# Altium schematic sheet KSZ8851SNL.SchDoc
size 355 x 203 mm; SheetNumber: 2; SheetTotal: 3
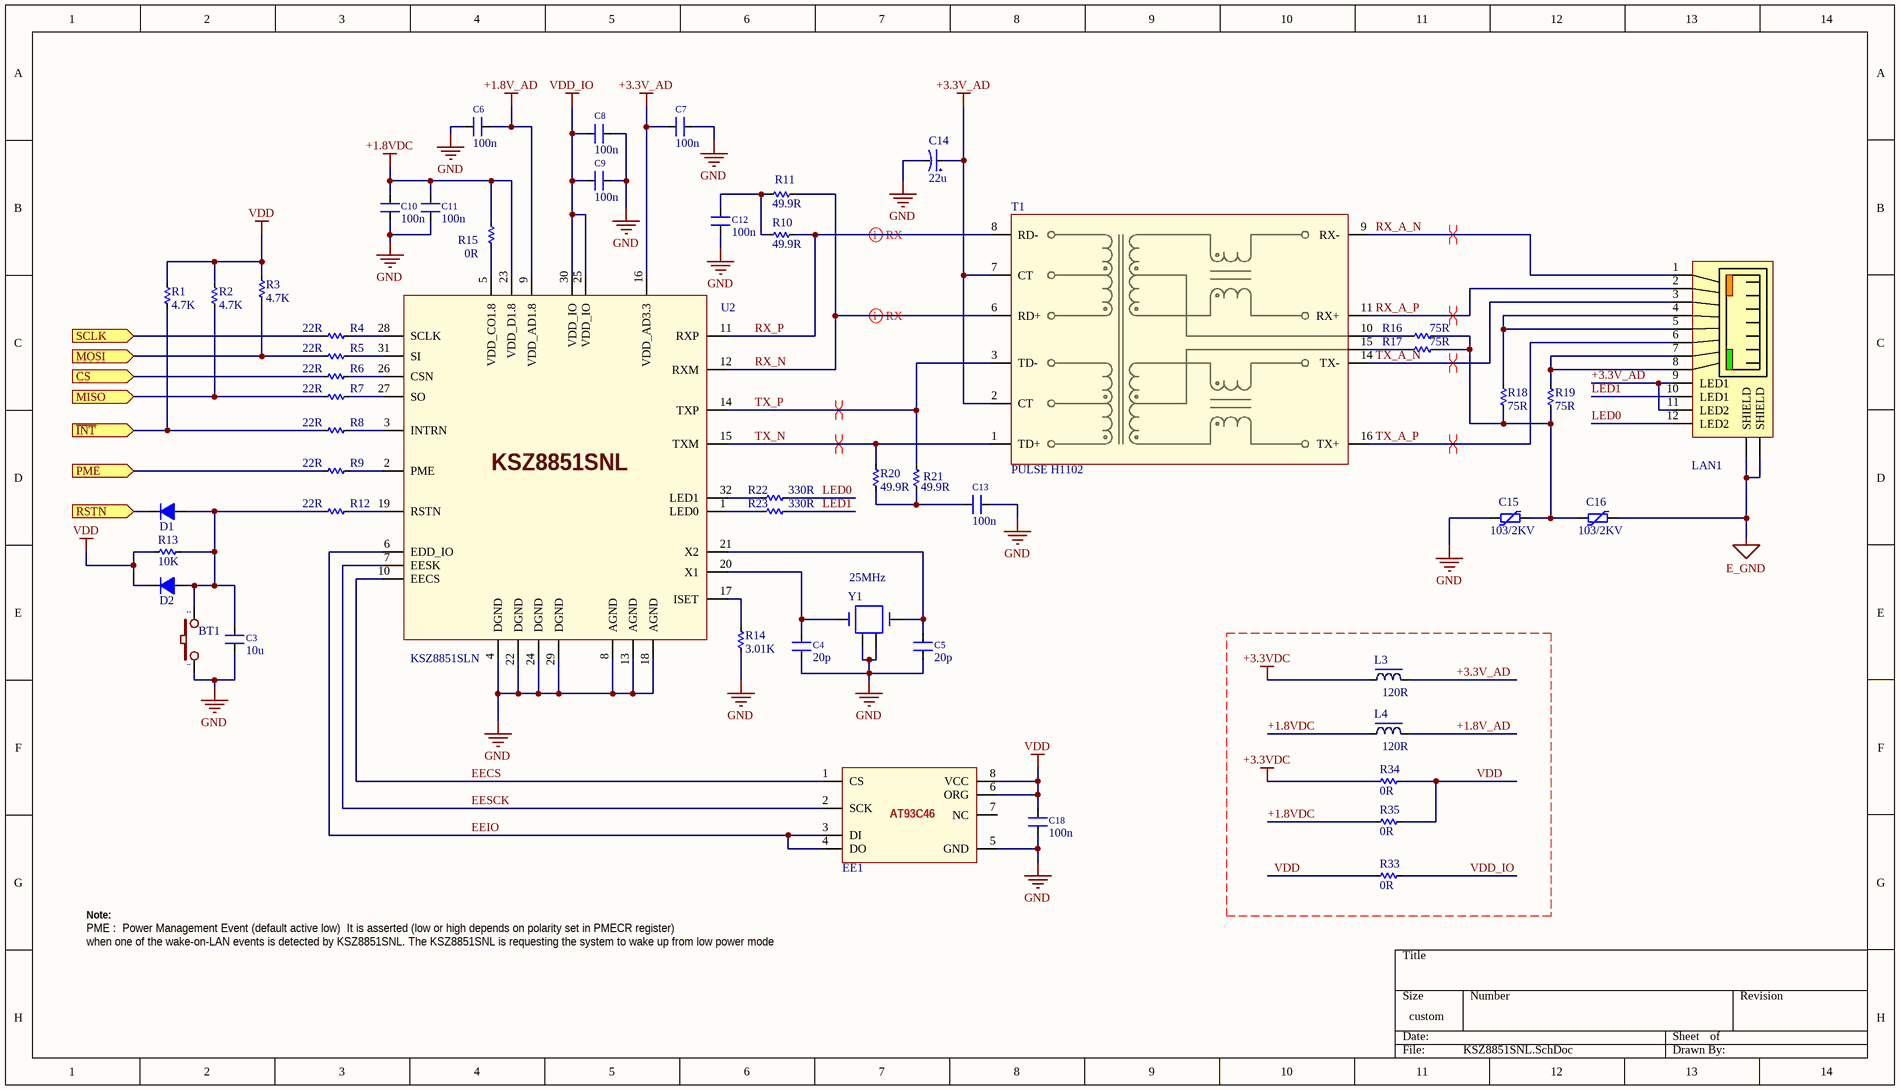
[diagram p0: KSZ8851SNL.SchDoc]

## Parts
BT1  BUTTON1  [SW-SMD - 3x4]  (value not drawn)
C3  10u  [CN-SMD-1206]
C4  20p  [CN-SMD-0603]
C5  20p  [CN-SMD-0603]
C6  100n  [CN-SMD-0805]
C7  100n  [CN-SMD-0805]
C8  100n  [CN-SMD-0805]
C9  100n  [CN-SMD-0805]
C10  100n  [CN-SMD-0805]
C11  100n  [CN-SMD-0805]
C12  100n  [CN-SMD-0805]
C13  100n  [CN-SMD-0805]
C14  22u  [CAP-ALU-SMD-5.5x5.5]
C15  103/2KV  [MOV-7D]
C16  103/2KV  [MOV-7D]
C18  100n  [CN-SMD-0805]
D1  Diode  1N4007  [SOD-123]  (value not drawn)
D2  Diode  1N4007  [SOD-123]  (value not drawn)
EE1  AT93C46D  [SOP-8_mini]  (value not drawn)
L3  120R  [IN-SMD-0603]
L4  120R  [IN-SMD-0603]
LAN1  RJHSE-5381  [RJ45]  (value not drawn)
R1  4.7K  [RES-SMD-0603]
R2  4.7K  [RES-SMD-0603]
R3  4.7K  [RES-SMD-0603]
R4  22R  [RES-SMD-0603]
R5  22R  [RES-SMD-0603]
R6  22R  [RES-SMD-0603]
R7  22R  [RES-SMD-0603]
R8  22R  [RES-SMD-0603]
R9  22R  [RES-SMD-0603]
R10  49.9R  [RES-SMD-0805]
R11  49.9R  [RES-SMD-0805]
R12  22R  [RES-SMD-0603]
R13  10K  [RES-SMD-0603]
R14  3.01K  [RES-SMD-0603]
R15  0R  [RES-SMD-0603]
R16  75R  [RES-SMD-0805]
R17  75R  [RES-SMD-0805]
R18  75R  [RES-SMD-0805]
R19  75R  [RES-SMD-0805]
R20  49.9R  [RES-SMD-0805]
R21  49.9R  [RES-SMD-0805]
R22  330R  [RES-SMD-0805]
R23  330R  [RES-SMD-0805]
R33  0R  [RES-SMD-0805]
R34  0R  [RES-SMD-0805]
R35  0R  [RES-SMD-0805]
T1  PULSE H1102  [PULSE-H1102NL]
U2  KSZ8851SLN  [QFN32-32]
Y1  25MHz  [Crystal 4 pin SMD 32x25]

## Ports
CS (in), MISO (in), MOSI (in), PME (in), RSTN (in), SCLK (in), ~{INT} (in)

## Nets
+1.8V_AD: C6.2 L4.2 U2.9(VDD_AD1.8)
+1.8VDC: C10.1 C11.1 L4.1 R15.2 R35.1 U2.23(VDD_D1.8)
+3.3V_AD: C7.1 C14.1 L3.2 LAN1.9(LED1) LAN1.11(LED2) T1.2(CT) T1.7(CT) U2.16(VDD_AD3.3)
+3.3VDC: L3.1 R34.1
E_GND: C16.2 LAN1.SHIELD
GND: BT1.1 C3.1 C4.1 C5.1 C6.1 C7.2 C8.2 C9.2 C10.2 C11.2 C12.2 C13.1 C14.2 C15.1 C18.2 EE1.5(GND) R14.2 U2.4(DGND) U2.8(AGND) U2.13(AGND) U2.18(AGND) U2.22(DGND) U2.24(DGND) U2.29(DGND) Y1.2(GND) Y1.4(GND)
VDD: C18.1 D2.2 EE1.6(ORG) EE1.8(VCC) R1.2 R2.2 R3.2 R13.2 R33.1 R34.2 R35.2
VDD_IO: C8.1 C9.1 R33.2 U2.25(VDD_IO) U2.30(VDD_IO)
CS: R6.1 ; port CS
EECS: EE1.1(CS) U2.10(EECS)
EEIO: EE1.3(DI) EE1.4(DO) U2.6(EDD_IO)
EESCK: EE1.2(SCK) U2.7(EESK)
~{INT}: R1.1 R8.1 ; port ~{INT}
LED0: LAN1.12(LED2) R22.2
LED1: LAN1.10(LED1) R23.2
MISO: R2.1 R7.1 ; port MISO
MOSI: R3.1 R5.1 ; port MOSI
PME: R9.1 ; port PME
RSTN: D1.2 ; port RSTN
RX_A_N: LAN1.1 T1.9(RX-)
RX_A_P: LAN1.2 T1.11(RX+)
RX_N: R11.1 T1.6(RD+) U2.12(RXM)
RX_P: R10.1 T1.8(RD-) U2.11(RXP)
SCLK: R4.1 ; port SCLK
TX_A_N: LAN1.3 T1.14(TX-)
TX_A_P: LAN1.6 T1.16(TX+)
TX_N: R20.1 T1.1(TD+) U2.15(TXM)
TX_P: R21.1 T1.3(TD-) U2.14(TXP)
NetBT1_2: BT1.2 C3.2 D1.1 D2.1 R12.1 R13.1
NetC4_2: C4.2 U2.20(X1) Y1.1(OSC1)
NetC5_2: C5.2 U2.21(X2) Y1.3(OSC2)
NetC12_1: C12.1 R10.2 R11.2
NetC13_2: C13.2 R20.2 R21.2
NetC15_2: C15.2 C16.1 R16.1 R17.1 R18.2 R19.2
NetLAN1_4: LAN1.4 LAN1.5 R18.1
NetLAN1_7: LAN1.7 LAN1.8 R19.1
NetR4_2: R4.2 U2.28(SCLK)
NetR5_2: R5.2 U2.31(SI)
NetR6_2: R6.2 U2.26(CSN)
NetR7_2: R7.2 U2.27(SO)
NetR8_2: R8.2 U2.3(INTRN)
NetR9_2: R9.2 U2.2(PME)
NetR12_2: R12.2 U2.19(RSTN)
NetR14_1: R14.1 U2.17(ISET)
NetR15_1: R15.1 U2.5(VDD_CO1.8)
NetR16_2: R16.2 T1.10
NetR17_2: R17.2 T1.15
NetR22_1: R22.1 U2.32(LED1)
NetR23_1: R23.1 U2.1(LED0)

Not connected (* = marked no-connect by the designer): EE1 7(NC)

## Layout directives
differential pair: RX_A_N, RX_A_P, RX_N, RX_P, TX_A_N, TX_A_P, TX_N, TX_P

## Notes on the sheet
- PME :  Power Management Event (default active low)  It is asserted (low or high depends on polarity set in PMECR register)
- Note:
- when one of the wake-on-LAN events is detected by KSZ8851SNL. The KSZ8851SNL is requesting the system to wake up from low power mode
- (in symbol AT93C46D) AT93C46
- (in symbol KSZ8851SLN) KSZ8851SNL

## Library data of the parts
BT1 = BUTTON1: Value: 1N4007
C3-C13 C18 = CAP SMD: Value: 0,1uF/300V; Designed by: VanDungEvn
C14 = CAP-ALU-SMD: Published: 8-Jun-2000; LatestRevisionDate: 17-Jul-2002; LatestRevisionNote: Re-released for DXP Platform.; PackageReference: POLAR0.8; Publisher: Altium Limited
C15 C16 = MOV
D1 D2 = Diode  1N4007: Diode 1A; Value: 1N4007
EE1 = AT93C46D: 3-wire Serial EEPROM
L3 L4 = inductor-SMD: Value: 150 mH
LAN1 = RJHSE-5381: https://pdf1.alldatasheet.com/datasheet-pdf/view/585698/AMPHENOL/RJHSE-5381.html
R1-R23 R33-R35 = Res-SMD: Resistor; Manufacturer: Generic Components; Class: Passive; Published: 08/06/2000; Publisher: Altium Hobart Technology Centre
Y1 = XTAL_4Pin SMD: Crystal Oscillator; Published: 8-Jun-2000; LatestRevisionDate: 17-Jul-2002; LatestRevisionNote: Re-released for DXP Platform.; PackageReference: R38; Publisher: Altium Limited